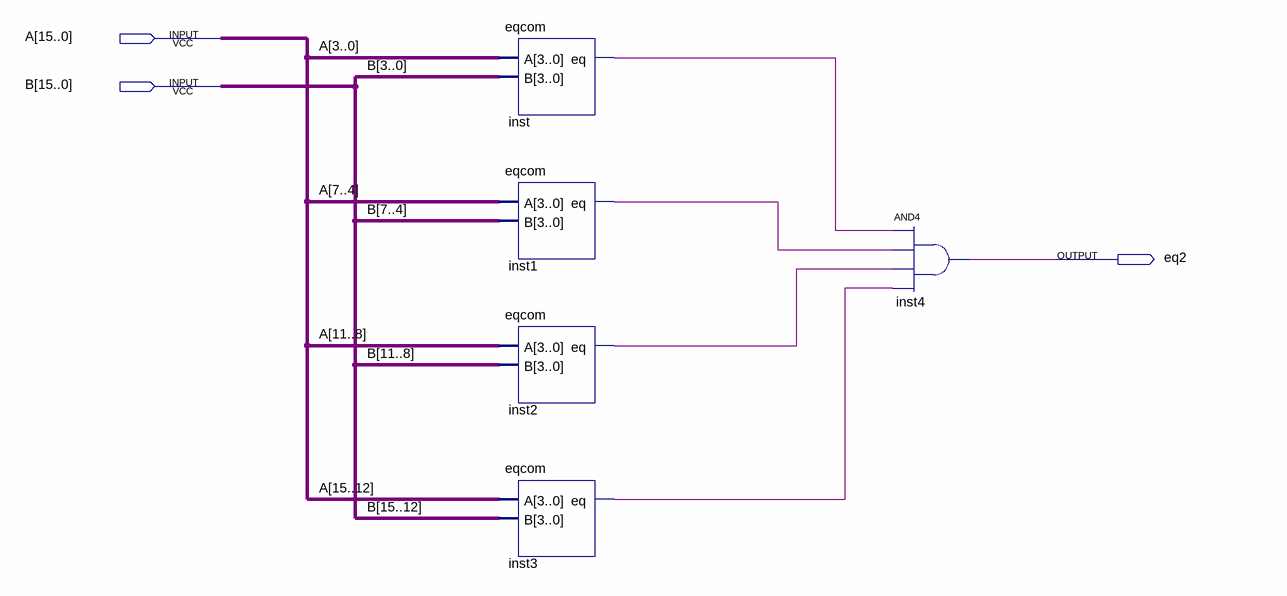
[diagram p0: schematic sheet]
// Quartus schematic onesixcom.bdf as structural Verilog: 5 symbols, 3 pins
module onesixcom (
  input  [15:0] A,
  input  [15:0] B,
  output eq2
);

  wire inst1_eq, inst2_eq, inst3_eq, inst_eq;

  eqcom inst (.A(A[3:0]), .B(B[3:0]), .eq(inst_eq));
  eqcom inst1 (.A(A[7:4]), .B(B[7:4]), .eq(inst1_eq));
  eqcom inst2 (.A(A[11:8]), .B(B[11:8]), .eq(inst2_eq));
  eqcom inst3 (.A(A[15:12]), .B(B[15:12]), .eq(inst3_eq));
  and inst4 (eq2, inst_eq, inst1_eq, inst2_eq, inst3_eq);
endmodule
